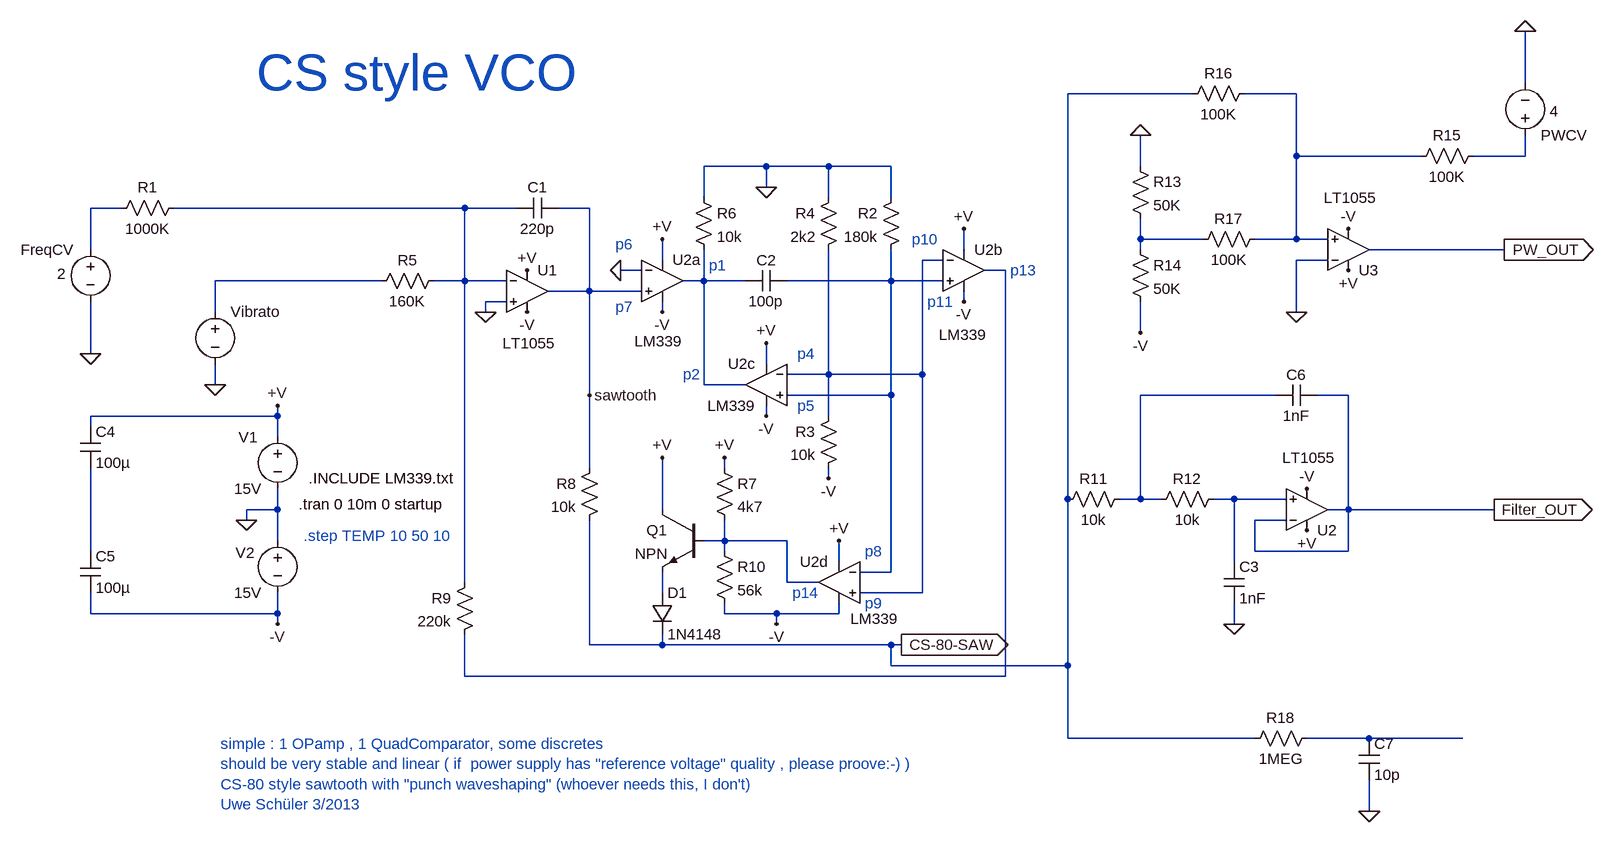
[diagram p0: schematic CS style VCO.asc]
CS style VCO.asc, the LTspice schematic file:
Version 4
SHEET 1 1720 1032
WIRE -3040 -4752 -3040 -4832
WIRE -3552 -4736 -3744 -4736
WIRE -3392 -4736 -3472 -4736
WIRE -3392 -4640 -3392 -4736
WIRE -3200 -4640 -3392 -4640
WIRE -3040 -4640 -3040 -4672
WIRE -3040 -4640 -3120 -4640
WIRE -4208 -4624 -4304 -4624
WIRE -4112 -4624 -4208 -4624
WIRE -4016 -4624 -4112 -4624
WIRE -3632 -4624 -3632 -4672
WIRE -4208 -4592 -4208 -4624
WIRE -4304 -4576 -4304 -4624
WIRE -4112 -4576 -4112 -4624
WIRE -4016 -4576 -4016 -4624
WIRE -5200 -4560 -5248 -4560
WIRE -4672 -4560 -5120 -4560
WIRE -4592 -4560 -4672 -4560
WIRE -4480 -4560 -4528 -4560
WIRE -3632 -4512 -3632 -4544
WIRE -3536 -4512 -3632 -4512
WIRE -3392 -4512 -3392 -4640
WIRE -3392 -4512 -3456 -4512
WIRE -3344 -4512 -3392 -4512
WIRE -5248 -4496 -5248 -4560
WIRE -3904 -4496 -3904 -4528
WIRE -3632 -4496 -3632 -4512
WIRE -3072 -4496 -3280 -4496
WIRE -4368 -4480 -4368 -4512
WIRE -3936 -4480 -3968 -4480
WIRE -3344 -4480 -3392 -4480
WIRE -4400 -4464 -4432 -4464
WIRE -3840 -4464 -3872 -4464
WIRE -4800 -4448 -5056 -4448
WIRE -4672 -4448 -4672 -4560
WIRE -4672 -4448 -4720 -4448
WIRE -4608 -4448 -4672 -4448
WIRE -4304 -4448 -4304 -4496
WIRE -4304 -4448 -4336 -4448
WIRE -4240 -4448 -4304 -4448
WIRE -4016 -4448 -4016 -4496
WIRE -4016 -4448 -4176 -4448
WIRE -3936 -4448 -4016 -4448
WIRE -4480 -4432 -4480 -4560
WIRE -4480 -4432 -4544 -4432
WIRE -4400 -4432 -4480 -4432
WIRE -4608 -4416 -4640 -4416
WIRE -3904 -4416 -3904 -4432
WIRE -5056 -4400 -5056 -4448
WIRE -4640 -4400 -4640 -4416
WIRE -4368 -4400 -4368 -4416
WIRE -3392 -4400 -3392 -4480
WIRE -3632 -4368 -3632 -4416
WIRE -5248 -4336 -5248 -4416
WIRE -4208 -4320 -4208 -4352
WIRE -4112 -4304 -4112 -4496
WIRE -4112 -4304 -4176 -4304
WIRE -3968 -4304 -3968 -4480
WIRE -3968 -4304 -4112 -4304
WIRE -5056 -4288 -5056 -4320
WIRE -4304 -4288 -4304 -4448
WIRE -4240 -4288 -4304 -4288
WIRE -4480 -4272 -4480 -4432
WIRE -4016 -4272 -4016 -4448
WIRE -4016 -4272 -4176 -4272
WIRE -3424 -4272 -3632 -4272
WIRE -3312 -4272 -3360 -4272
WIRE -4960 -4240 -4960 -4256
WIRE -4960 -4240 -5248 -4240
WIRE -4208 -4240 -4208 -4256
WIRE -4112 -4240 -4112 -4304
WIRE -5248 -4224 -5248 -4240
WIRE -4960 -4208 -4960 -4240
WIRE -4480 -4160 -4480 -4272
WIRE -4272 -4160 -4272 -4176
WIRE -4112 -4144 -4112 -4160
WIRE -3744 -4112 -3744 -4736
WIRE -3632 -4112 -3632 -4272
WIRE -3632 -4112 -3664 -4112
WIRE -3600 -4112 -3632 -4112
WIRE -3488 -4112 -3520 -4112
WIRE -3408 -4112 -3488 -4112
WIRE -4960 -4096 -4960 -4128
WIRE -4960 -4096 -5008 -4096
WIRE -4368 -4096 -4368 -4176
WIRE -3312 -4096 -3312 -4272
WIRE -3312 -4096 -3344 -4096
WIRE -3088 -4096 -3312 -4096
WIRE -5008 -4080 -5008 -4096
WIRE -3408 -4080 -3456 -4080
WIRE -4960 -4048 -4960 -4096
WIRE -4272 -4048 -4272 -4080
WIRE -4272 -4048 -4304 -4048
WIRE -4176 -4048 -4272 -4048
WIRE -5248 -4032 -5248 -4160
WIRE -4272 -4032 -4272 -4048
WIRE -3456 -4032 -3456 -4080
WIRE -3312 -4032 -3312 -4096
WIRE -3312 -4032 -3456 -4032
WIRE -4096 -4016 -4096 -4048
WIRE -3488 -4016 -3488 -4112
WIRE -4016 -4000 -4016 -4272
WIRE -4016 -4000 -4064 -4000
WIRE -4672 -3984 -4672 -4448
WIRE -4176 -3984 -4176 -4048
WIRE -4128 -3984 -4176 -3984
WIRE -4368 -3968 -4368 -4000
WIRE -3968 -3968 -3968 -4304
WIRE -3968 -3968 -4064 -3968
WIRE -5248 -3936 -5248 -3968
WIRE -4960 -3936 -4960 -3968
WIRE -4960 -3936 -5248 -3936
WIRE -4272 -3936 -4272 -3952
WIRE -4192 -3936 -4272 -3936
WIRE -4096 -3936 -4096 -3952
WIRE -4096 -3936 -4192 -3936
WIRE -4960 -3920 -4960 -3936
WIRE -4192 -3920 -4192 -3936
WIRE -3488 -3920 -3488 -3952
WIRE -4480 -3888 -4480 -4080
WIRE -4368 -3888 -4368 -3904
WIRE -4368 -3888 -4480 -3888
WIRE -4016 -3888 -4368 -3888
WIRE -4000 -3888 -4016 -3888
WIRE -4016 -3856 -4016 -3888
WIRE -3744 -3856 -3744 -4112
WIRE -3744 -3856 -4016 -3856
WIRE -4672 -3840 -4672 -3904
WIRE -3840 -3840 -3840 -4464
WIRE -3840 -3840 -4672 -3840
WIRE -3744 -3744 -3744 -3856
WIRE -3456 -3744 -3744 -3744
WIRE -3280 -3744 -3376 -3744
WIRE -3136 -3744 -3280 -3744
WIRE -3280 -3632 -3280 -3680
FLAG -5008 -4080 0
FLAG -4960 -3920 -V
FLAG -4576 -4464 +V
FLAG -4576 -4400 -V
FLAG -4000 -3888 CS-80-SAW
IOPIN -4000 -3888 Out
FLAG -5248 -4336 0
FLAG -4208 -4592 0
FLAG -4368 -4512 +V
FLAG -4432 -4464 0
FLAG -3904 -4528 +V
FLAG -4208 -4352 +V
FLAG -4272 -4176 +V
FLAG -4960 -4256 +V
FLAG -4368 -4400 -V
FLAG -3904 -4416 -V
FLAG -4208 -4240 -V
FLAG -4112 -4144 -V
FLAG -4480 -4272 sawtooth
FLAG -4368 -4176 +V
FLAG -4096 -4048 +V
FLAG -4192 -3920 -V
FLAG -4640 -4400 0
FLAG -5056 -4288 0
FLAG -3376 -4064 +V
FLAG -3376 -4128 -V
FLAG -3488 -3920 0
FLAG -3088 -4096 Filter_OUT
IOPIN -3088 -4096 Out
FLAG -3312 -4464 +V
FLAG -3312 -4528 -V
FLAG -3392 -4400 0
FLAG -3072 -4496 PW_OUT
IOPIN -3072 -4496 Out
FLAG -3632 -4368 -V
FLAG -3632 -4672 0
FLAG -3040 -4832 0
FLAG -3280 -3632 0
SYMBOL voltage -4960 -4224 M0
WINDOW 123 0 0 Left 2
WINDOW 39 0 0 Left 2
WINDOW 0 31 17 Left 2
SYMATTR InstName V1
SYMATTR Value 15V
SYMBOL voltage -4960 -4064 M0
WINDOW 123 0 0 Left 2
WINDOW 39 0 0 Left 2
WINDOW 0 35 34 Left 2
SYMATTR InstName V2
SYMATTR Value 15V
SYMBOL cap -4528 -4544 M270
WINDOW 3 0 32 VBottom 2
WINDOW 0 32 32 VTop 2
SYMATTR Value 220p
SYMATTR InstName C1
SYMBOL Opamps\\LT1055 -4576 -4496 R0
WINDOW 3 -38 144 Left 2
SYMATTR InstName U1
SYMBOL res -5104 -4576 R90
WINDOW 0 0 56 VBottom 2
WINDOW 3 32 56 VTop 2
SYMATTR InstName R1
SYMATTR Value 1000K
SYMBOL voltage -5248 -4512 M0
WINDOW 123 0 0 Left 2
WINDOW 39 0 0 Left 2
WINDOW 3 38 53 Left 2
SYMATTR Value 2
SYMATTR InstName FreqCV
SYMBOL cap -4240 -4432 R270
WINDOW 0 32 32 VTop 2
WINDOW 3 0 32 VBottom 2
SYMATTR InstName C2
SYMATTR Value 100p
SYMBOL res -4000 -4592 M0
SYMATTR InstName R2
SYMATTR Value 180k
SYMBOL Opamps\\opamp2 -4368 -4512 R0
WINDOW 3 -43 157 Left 2
SYMATTR Value LM339
SYMATTR InstName U2a
SYMBOL Opamps\\opamp2 -3904 -4528 R0
WINDOW 3 -38 163 Left 2
SYMATTR Value LM339
SYMATTR InstName U2b
SYMBOL res -4096 -4256 M0
SYMATTR InstName R3
SYMATTR Value 10k
SYMBOL res -4096 -4592 M0
SYMATTR InstName R4
SYMATTR Value 2k2
SYMBOL res -4704 -4464 R90
WINDOW 0 0 56 VBottom 2
WINDOW 3 32 56 VTop 2
SYMATTR InstName R5
SYMATTR Value 160K
SYMBOL res -4320 -4592 R0
SYMATTR InstName R6
SYMATTR Value 10k
SYMBOL Opamps\\opamp2 -4208 -4352 M0
SYMATTR InstName U2c
SYMATTR Value LM339
SYMBOL res -4288 -4176 R0
SYMATTR InstName R7
SYMATTR Value 4k7
SYMBOL res -4464 -4176 M0
SYMATTR InstName R8
SYMATTR Value 10k
SYMBOL res -4656 -4000 M0
SYMATTR InstName R9
SYMATTR Value 220k
SYMBOL Opamps\\opamp2 -4096 -4048 M0
WINDOW 3 -92 120 Left 2
SYMATTR Value LM339
SYMATTR InstName U2d
SYMBOL res -4288 -4048 R0
SYMATTR InstName R10
SYMATTR Value 56k
SYMBOL npn -4304 -4096 M0
SYMATTR InstName Q1
SYMBOL cap -5264 -4224 R0
SYMATTR InstName C4
SYMATTR Value 100µ
SYMBOL cap -5264 -4032 R0
SYMATTR InstName C5
SYMATTR Value 100µ
SYMBOL voltage -5056 -4416 R0
WINDOW 123 0 0 Left 2
WINDOW 39 0 0 Left 2
SYMATTR InstName Vibrato
SYMATTR Value ""
SYMBOL Opamps\\LT1055 -3376 -4032 M180
WINDOW 3 -38 144 Left 2
SYMATTR InstName U2
SYMBOL cap -3504 -4016 R0
SYMATTR InstName C3
SYMATTR Value 1nF
SYMBOL cap -3360 -4288 R90
WINDOW 0 0 32 VBottom 2
WINDOW 3 32 32 VTop 2
SYMATTR InstName C6
SYMATTR Value 1nF
SYMBOL res -3648 -4128 R90
WINDOW 0 0 56 VBottom 2
WINDOW 3 32 56 VTop 2
SYMATTR InstName R11
SYMATTR Value 10k
SYMBOL res -3504 -4128 R90
WINDOW 0 0 56 VBottom 2
WINDOW 3 32 56 VTop 2
SYMATTR InstName R12
SYMATTR Value 10k
SYMBOL Opamps\\LT1055 -3312 -4432 M180
WINDOW 3 -38 144 Left 2
SYMATTR InstName U3
SYMBOL res -3648 -4640 R0
SYMATTR InstName R13
SYMATTR Value 50K
SYMBOL res -3648 -4512 R0
SYMATTR InstName R14
SYMATTR Value 50K
SYMBOL res -3104 -4656 R90
WINDOW 0 0 56 VBottom 2
WINDOW 3 32 56 VTop 2
SYMATTR InstName R15
SYMATTR Value 100K
SYMBOL res -3456 -4752 R90
WINDOW 0 0 56 VBottom 2
WINDOW 3 32 56 VTop 2
SYMATTR InstName R16
SYMATTR Value 100K
SYMBOL res -3440 -4528 R90
WINDOW 0 0 56 VBottom 2
WINDOW 3 32 56 VTop 2
SYMATTR InstName R17
SYMATTR Value 100K
SYMBOL voltage -3040 -4656 M180
WINDOW 123 0 0 Left 2
WINDOW 39 0 0 Left 2
WINDOW 3 38 53 Left 2
SYMATTR Value 4
SYMATTR InstName PWCV
SYMBOL diode -4384 -3968 R0
SYMATTR InstName D1
SYMATTR Value 1N4148
SYMBOL res -3360 -3760 R90
WINDOW 0 0 56 VBottom 2
WINDOW 3 32 56 VTop 2
SYMATTR InstName R18
SYMATTR Value 1MEG
SYMBOL cap -3296 -3744 R0
SYMATTR InstName C7
SYMATTR Value 10p
TEXT -4928 -4104 Left 2 !.tran 0 10m 0 startup
TEXT -4912 -4144 Left 2 !.INCLUDE LM339.txt
TEXT -4920 -4056 Left 2 ;.step TEMP 10 50 10
TEXT -4992 -4768 Left 6 ;CS style VCO
TEXT -5048 -3736 Left 2 ;simple : 1 OPamp , 1 QuadComparator, some discretes\nshould be very stable and linear ( if  power supply has "reference voltage" quality , please proove:-) )\nCS-80 style sawtooth with "punch waveshaping" (whoever needs this, I don't)\nUwe Schüler 3/2013
TEXT -4440 -4408 Left 2 ;p7
TEXT -4440 -4504 Left 2 ;p6
TEXT -4296 -4472 Left 2 ;p1
TEXT -3832 -4464 Left 2 ;p13
TEXT -3984 -4512 Left 2 ;p10
TEXT -3960 -4416 Left 2 ;p11
TEXT -4168 -3968 Left 2 ;p14
TEXT -4056 -4032 Left 2 ;p8
TEXT -4056 -3952 Left 2 ;p9
TEXT -4336 -4304 Left 2 ;p2
TEXT -4160 -4336 Left 2 ;p4
TEXT -4160 -4256 Left 2 ;p5

The netlist it stands for:
* CS style VCO.asc
V1 +V 0 15V
V2 0 -V 15V
C1 sawtooth N004 220p
XU1 0 N004 +V -V sawtooth LT1055  ; pins In+ In- V+ V- OUT
R1 N004 N003 1000K
V§FreqCV N003 0 2
C2 N009 N010 100p
R2 0 N010 180k
XU2a sawtooth 0 +V -V N009 LM339  ; pins In+ In- V+ V- OUT
XU2b N010 N006 +V -V N007 LM339  ; pins In+ In- V+ V- OUT
R3 N006 -V 10k
R4 0 N006 2k2
R5 N004 N008 160K
R6 0 N009 10k
XU2c N010 N006 +V -V N009 LM339  ; pins In+ In- V+ V- OUT
R7 +V N013 4k7
R8 sawtooth CS-80-SAW 10k
R9 N004 N007 220k
XU2d N006 N010 +V -V N013 LM339  ; pins In+ In- V+ V- OUT
R10 N013 -V 56k
Q1 +V N013 N015 0 NPN
C4 +V N014 100µ
C5 N014 -V 100µ
Vibrato N008 0
XU2 N012 Filter_OUT +V -V Filter_OUT LT1055  ; pins In+ In- V+ V- OUT
C3 N012 0 1nF
C6 Filter_OUT N011 1nF
R11 N011 CS-80-SAW 10k
R12 N012 N011 10k
XU3 N001 0 +V -V PW_OUT LT1055  ; pins In+ In- V+ V- OUT
R13 0 N005 50K
R14 N005 -V 50K
R15 N002 N001 100K
R16 N001 CS-80-SAW 100K
R17 N001 N005 100K
V§PWCV N002 0 4
D1 N015 CS-80-SAW 1N4148
R18 N016 CS-80-SAW 1MEG
C7 N016 0 10p
.model D D
.lib standard.dio
.model NPN NPN
.model PNP PNP
.lib standard.bjt
.tran 0 10m 0 startup
.INCLUDE LM339.txt
* .step TEMP 10 50 10
* CS style VCO
* simple : 1 OPamp , 1 QuadComparator, some discretes
* should be very stable and linear ( if  power supply has "reference voltage" quality , please proove:-) )
* CS-80 style sawtooth with "punch waveshaping" (whoever needs this, I don't)
* Uwe Schüler 3/2013
* p7
* p6
* p1
* p13
* p10
* p11
* p14
* p8
* p9
* p2
* p4
* p5
.backanno
.end